# EAGLE design dev-v1.0 (EAGLE 7.2.0)

## Sheet 1 of 5: Main Microcontroller
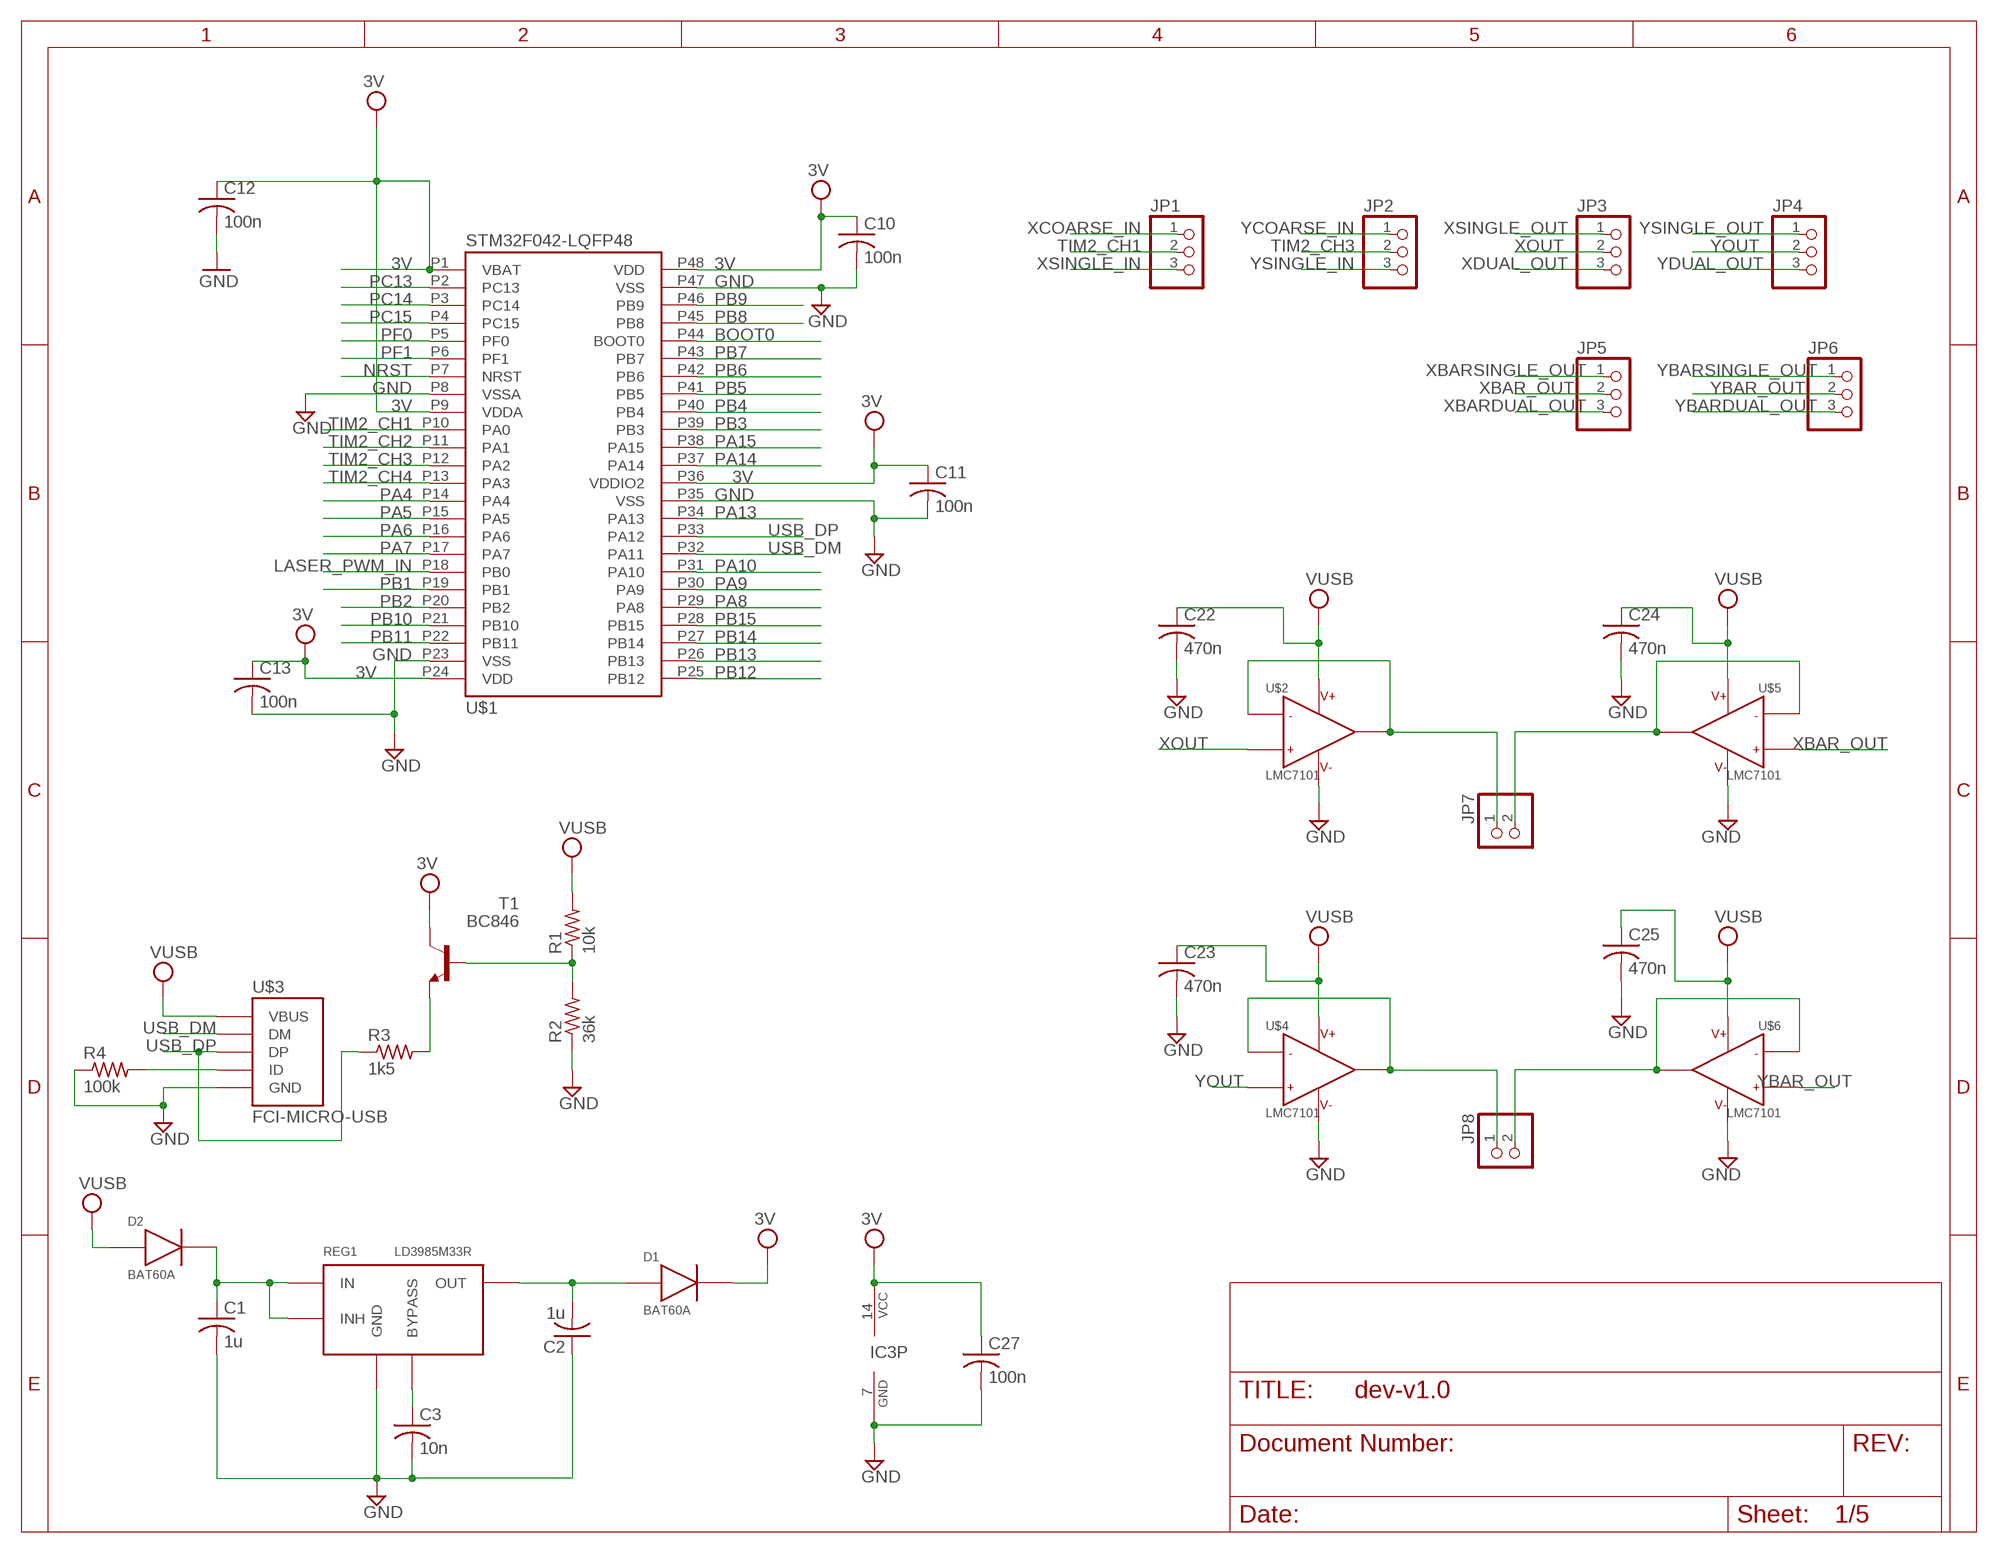
[diagram p0: schematic, sheet 1]

### Parts
C1  1u  C-USC0603  [C0603]
C2  1u  C-USC0603  [C0603]
C3  10n  C-USC0603  [C0603]
C10  100n  C-USC0603  [C0603]
C11  100n  C-USC0603  [C0603]
C12  100n  C-USC0603  [C0603]
C13  100n  C-USC0603  [C0603]
C22  470n  C-USC0603  [C0603]
C23  470n  C-USC0603  [C0603]
C24  470n  C-USC0603  [C0603]
C25  470n  C-USC0603  [C0603]
C27  100n  C-USC0603  [C0603]
D1  BAT60A  [SOD323]
D2  BAT60A  [SOD323]
IC3  74S04D  [SO14]
JP1  PINHD-1X3  [1X03]
JP2  PINHD-1X3  [1X03]
JP3  PINHD-1X3  [1X03]
JP4  PINHD-1X3  [1X03]
JP5  PINHD-1X3  [1X03]
JP6  PINHD-1X3  [1X03]
JP7  PINHD-1X2  [1X02]
JP8  PINHD-1X2  [1X02]
R1  10k  R-US_R0603  [R0603]
R2  36k  R-US_R0603  [R0603]
R3  1k5  R-US_R0603  [R0603]
R4  100k  R-US_R0603  [R0603]
REG1  LD3985M33R  LD3985MXXR  [SOT23-5L]
T1  BC846  [SOT23]
U$1  STM32F042-LQFP48  [LQFP48]
U$2  LMC7101  [SOT23-5]
U$3  FCI-MICRO-USB  [FCI-MICROUSB]
U$4  LMC7101  [SOT23-5]
U$5  LMC7101  [SOT23-5]
U$6  LMC7101  [SOT23-5]

### Nets
3V: C10.1 C11.1 C12.1 C13.1 C27.1 D1.1 IC3.14(P:VCC) T1.3(C) U$1.P1(VBAT) U$1.P9(VDDA) U$1.P24(VDD) U$1.P36(VDDIO2) U$1.P48(VDD) ; also sheet 5
3V3: C2.2 D1.2 REG1.OUT
BOOT0: U$1.P44(BOOT0) ; also sheet 5
GND: C1.2 C2.1 C3.2 C10.2 C11.2 C12.2 C13.2 C22.2 C23.2 C24.2 C25.2 C27.2 IC3.7(P:GND) R2.1 R4.1 REG1.GND U$1.P8(VSSA) U$1.P23(VSS) U$1.P35(VSS) U$1.P47(VSS) U$2.5 U$3.P5(GND) U$4.5 U$5.5 U$6.5 ; also sheet 2,3,4,5
LASER_PWM_IN: U$1.P18(PB0) ; also sheet 4,5
N$1: C3.1 REG1.BYPASS
N$2: R1.1 R2.2 T1.1(B)
N$3: R3.2 T1.2(E)
N$4: C1.1 D2.1 REG1.IN REG1.INHIBIT(INH)
N$5: R4.2 U$3.P4(ID)
N$7: JP7.1 U$2.1 U$2.4
N$9: JP8.1 U$4.1 U$4.4
N$16: JP7.2 U$5.1 U$5.4
N$17: JP8.2 U$6.1 U$6.4
NRST: U$1.P7(NRST) ; also sheet 5
PA4: U$1.P14(PA4) ; also sheet 5
PA5: U$1.P15(PA5) ; also sheet 5
PA6: U$1.P16(PA6) ; also sheet 5
PA7: U$1.P17(PA7) ; also sheet 5
PA8: U$1.P29(PA8) ; also sheet 5
PA9: U$1.P30(PA9) ; also sheet 5
PA10: U$1.P31(PA10) ; also sheet 5
PA13: U$1.P34(PA13) ; also sheet 5
PA14: U$1.P37(PA14) ; also sheet 5
PA15: U$1.P38(PA15) ; also sheet 5
PB1: U$1.P19(PB1) ; also sheet 5
PB2: U$1.P20(PB2) ; also sheet 5
PB3: U$1.P39(PB3) ; also sheet 5
PB4: U$1.P40(PB4) ; also sheet 5
PB5: U$1.P41(PB5) ; also sheet 5
PB6: U$1.P42(PB6) ; also sheet 5
PB7: U$1.P43(PB7) ; also sheet 5
PB8: U$1.P45(PB8) ; also sheet 5
PB9: U$1.P46(PB9) ; also sheet 5
PB10: U$1.P21(PB10) ; also sheet 5
PB11: U$1.P22(PB11) ; also sheet 5
PB12: U$1.P25(PB12) ; also sheet 5
PB13: U$1.P26(PB13) ; also sheet 5
PB14: U$1.P27(PB14) ; also sheet 5
PB15: U$1.P28(PB15) ; also sheet 5
PC13: U$1.P2(PC13) ; also sheet 5
PC14: U$1.P3(PC14) ; also sheet 5
PC15: U$1.P4(PC15) ; also sheet 5
PF0: U$1.P5(PF0) ; also sheet 5
PF1: U$1.P6(PF1) ; also sheet 5
TIM2_CH1: JP1.2 U$1.P10(PA0) ; also sheet 5
TIM2_CH2: U$1.P11(PA1) ; also sheet 5
TIM2_CH3: JP2.2 U$1.P12(PA2) ; also sheet 5
TIM2_CH4: U$1.P13(PA3) ; also sheet 5
USB_DM: U$1.P32(PA11) U$3.P2(DM) ; also sheet 5
USB_DP: R3.1 U$1.P33(PA12) U$3.P3(DP) ; also sheet 5
VUSB: C22.1 C23.1 C24.1 C25.1 D2.2 R1.2 U$2.2 U$3.P1(VBUS) U$4.2 U$5.2 U$6.2 ; also sheet 4
XBAR_OUT: JP5.2 U$5.3
XBARDUAL_OUT: JP5.3 ; also sheet 3
XBARSINGLE_OUT: JP5.1 ; also sheet 2
XCOARSE_IN: JP1.1 ; also sheet 3
XDUAL_OUT: JP3.3 ; also sheet 3
XOUT: JP3.2 U$2.3
XSINGLE_IN: JP1.3 ; also sheet 2
XSINGLE_OUT: JP3.1 ; also sheet 2
YBAR_OUT: JP6.2 U$6.3
YBARDUAL_OUT: JP6.3 ; also sheet 3
YBARSINGLE_OUT: JP6.1 ; also sheet 2
YCOARSE_IN: JP2.1 ; also sheet 3
YDUAL_OUT: JP4.3 ; also sheet 3
YOUT: JP4.2 U$4.3
YSINGLE_IN: JP2.3 ; also sheet 2
YSINGLE_OUT: JP4.1 ; also sheet 2

## Sheet 2 of 5: Single PWM
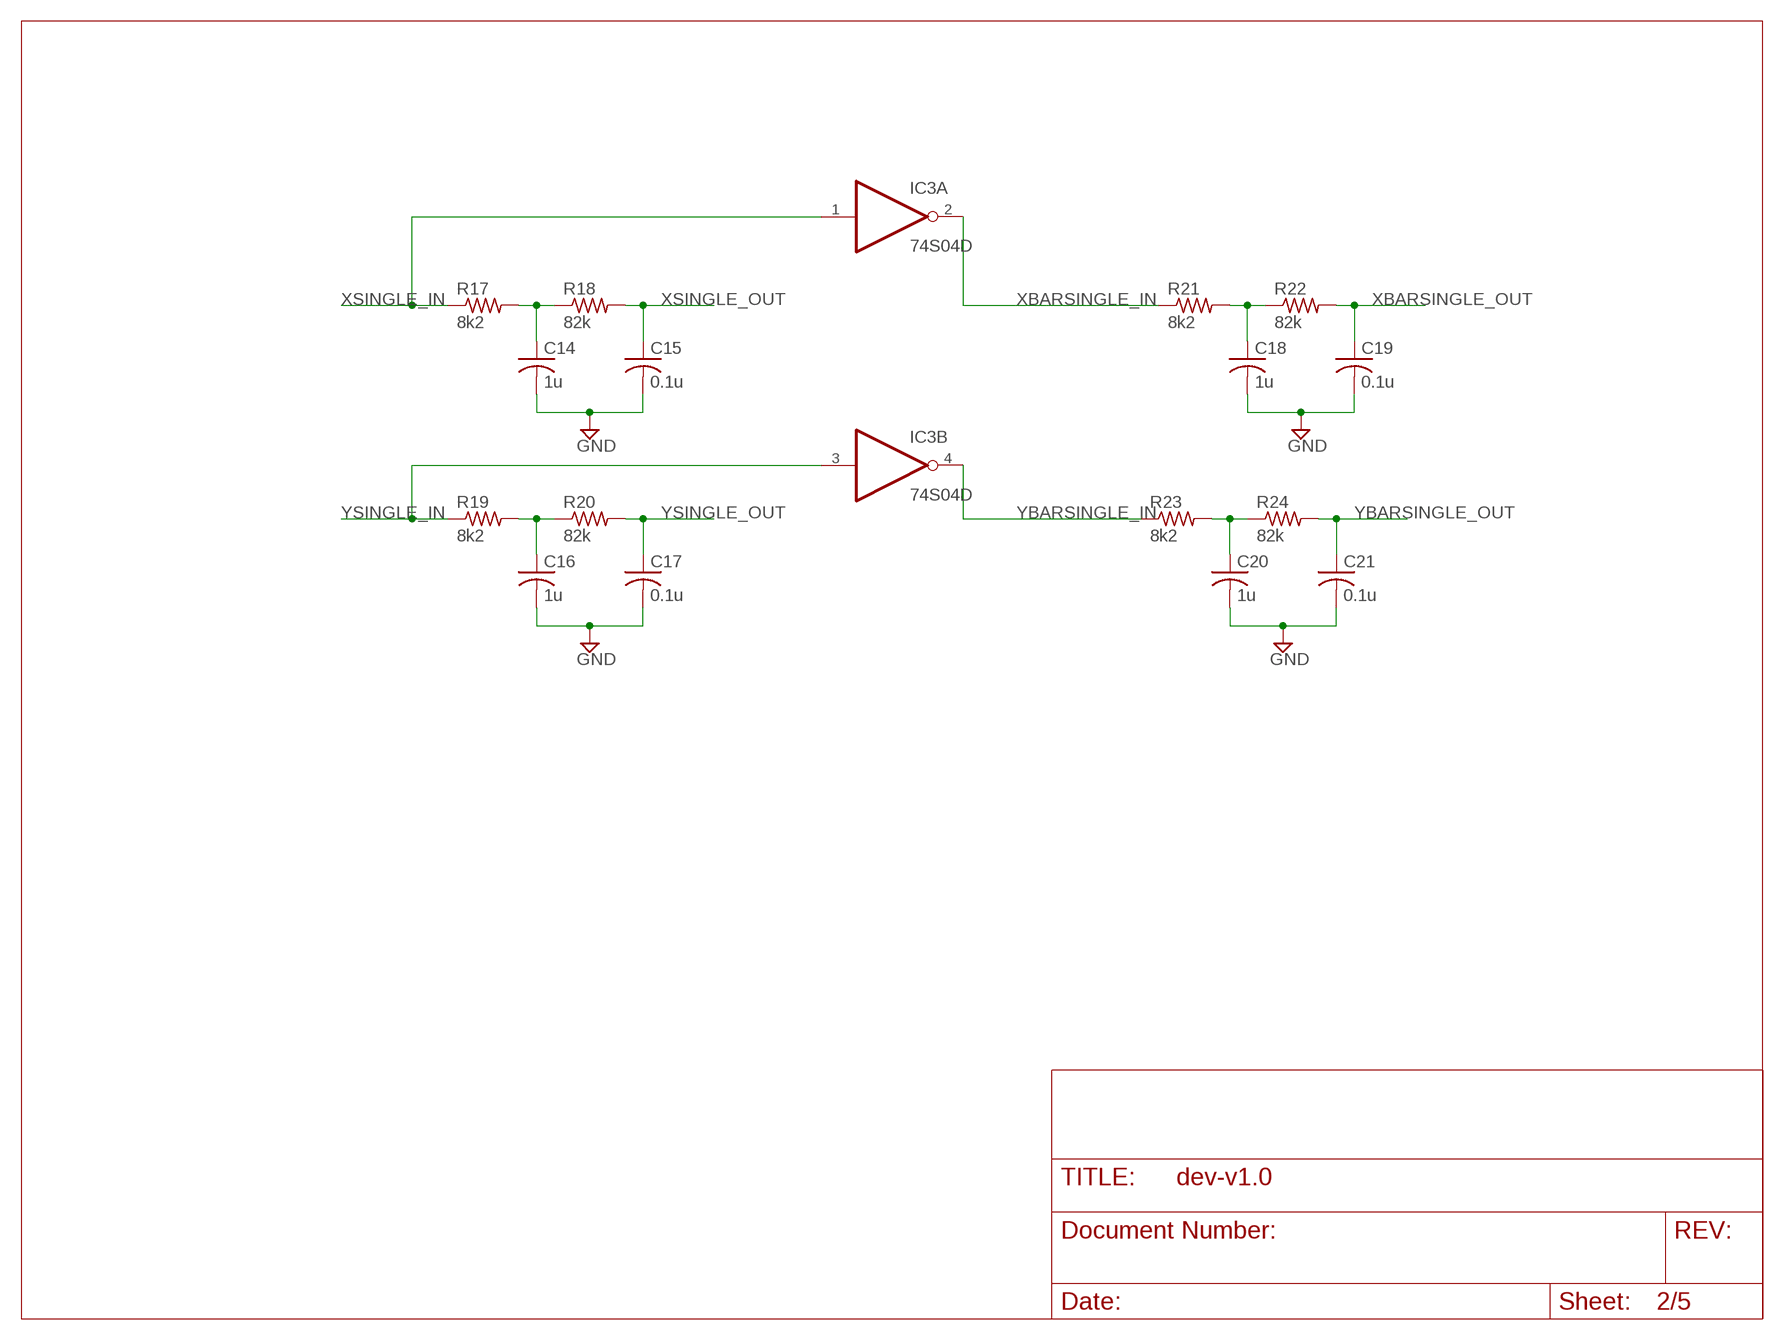
[diagram p1: schematic, sheet 2]

### Parts
C14  1u  C-USC0603  [C0603]
C15  0.1u  C-USC0603  [C0603]
C16  1u  C-USC0603  [C0603]
C17  0.1u  C-USC0603  [C0603]
C18  1u  C-USC0603  [C0603]
C19  0.1u  C-USC0603  [C0603]
C20  1u  C-USC0603  [C0603]
C21  0.1u  C-USC0603  [C0603]
R17  8k2  R-US_R0603  [R0603]
R18  82k  R-US_R0603  [R0603]
R19  8k2  R-US_R0603  [R0603]
R20  82k  R-US_R0603  [R0603]
R21  8k2  R-US_R0603  [R0603]
R22  82k  R-US_R0603  [R0603]
R23  8k2  R-US_R0603  [R0603]
R24  82k  R-US_R0603  [R0603]

### Nets
GND: C14.2 C15.2 C16.2 C17.2 C18.2 C19.2 C20.2 C21.2 ; also sheet 1,3,4,5
N$12: C14.1 R17.2 R18.1
N$13: C16.1 R19.2 R20.1
N$14: C18.1 R21.2 R22.1
N$15: C20.1 R23.2 R24.1
XBARSINGLE_IN: IC3.2(A:O) R21.1
XBARSINGLE_OUT: C19.1 R22.2 ; also sheet 1
XSINGLE_IN: IC3.1(A:I) R17.1 ; also sheet 1
XSINGLE_OUT: C15.1 R18.2 ; also sheet 1
YBARSINGLE_IN: IC3.4(B:O) R23.1
YBARSINGLE_OUT: C21.1 R24.2 ; also sheet 1
YSINGLE_IN: IC3.3(B:I) R19.1 ; also sheet 1
YSINGLE_OUT: C17.1 R20.2 ; also sheet 1

## Sheet 3 of 5: Dual PWM
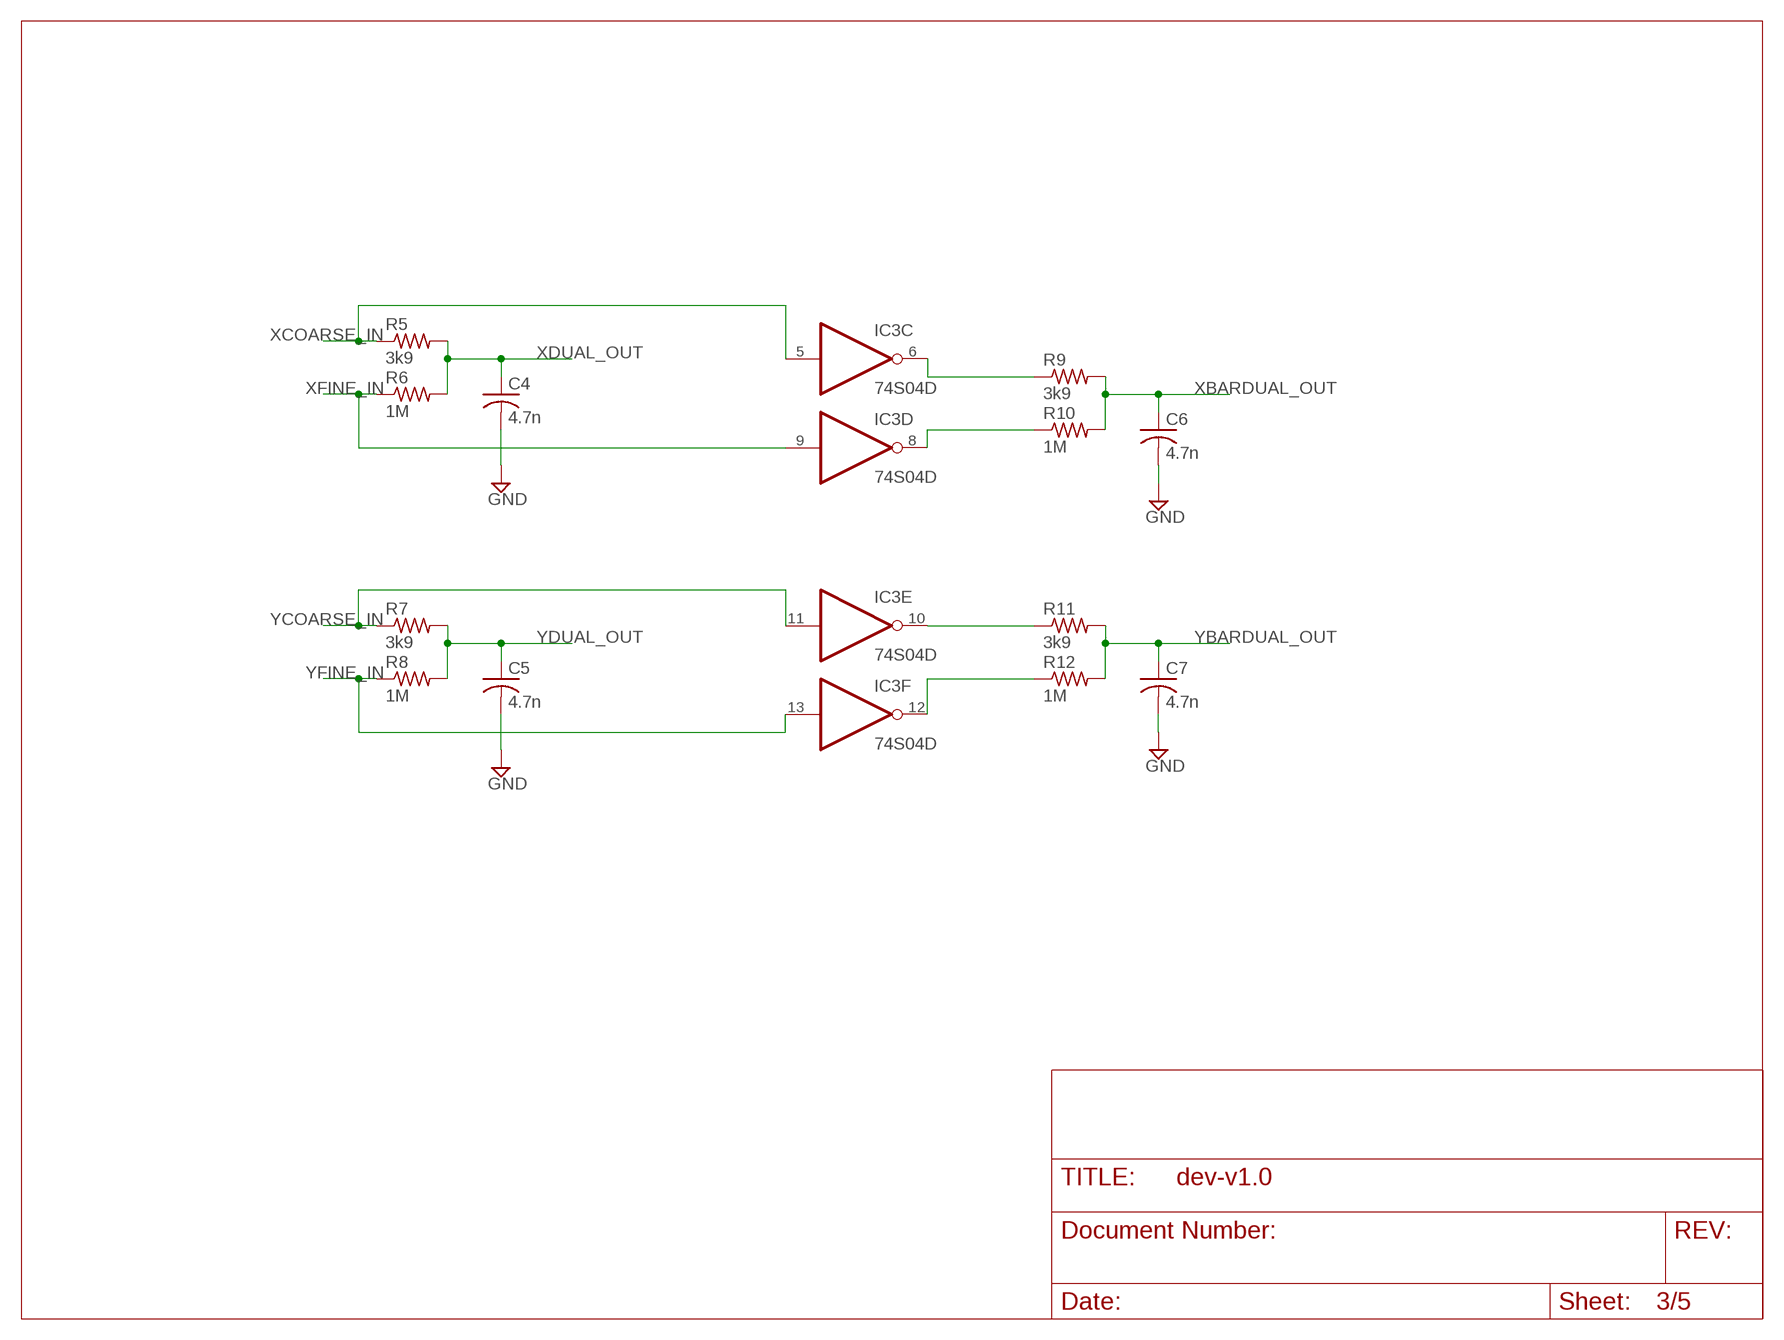
[diagram p2: schematic, sheet 3]

### Parts
C4  4.7n  C-USC0603  [C0603]
C5  4.7n  C-USC0603  [C0603]
C6  4.7n  C-USC0603  [C0603]
C7  4.7n  C-USC0603  [C0603]
R5  3k9  R-US_R0603  [R0603]
R6  1M  R-US_R0603  [R0603]
R7  3k9  R-US_R0603  [R0603]
R8  1M  R-US_R0603  [R0603]
R9  3k9  R-US_R0603  [R0603]
R10  1M  R-US_R0603  [R0603]
R11  3k9  R-US_R0603  [R0603]
R12  1M  R-US_R0603  [R0603]

### Nets
GND: C4.2 C5.2 C6.2 C7.2 ; also sheet 1,2,4,5
N$6: IC3.10(E:O) R11.1
N$8: IC3.12(F:O) R12.1
N$10: IC3.8(D:O) R10.1
N$11: IC3.6(C:O) R9.1
XBARDUAL_OUT: C6.1 R9.2 R10.2 ; also sheet 1
XCOARSE_IN: IC3.5(C:I) R5.1 ; also sheet 1
XDUAL_OUT: C4.1 R5.2 R6.2 ; also sheet 1
XFINE_IN: IC3.9(D:I) R6.1
YBARDUAL_OUT: C7.1 R11.2 R12.2 ; also sheet 1
YCOARSE_IN: IC3.11(E:I) R7.1 ; also sheet 1
YDUAL_OUT: C5.1 R7.2 R8.2 ; also sheet 1
YFINE_IN: IC3.13(F:I) R8.1

## Sheet 4 of 5: Laser Power Driver
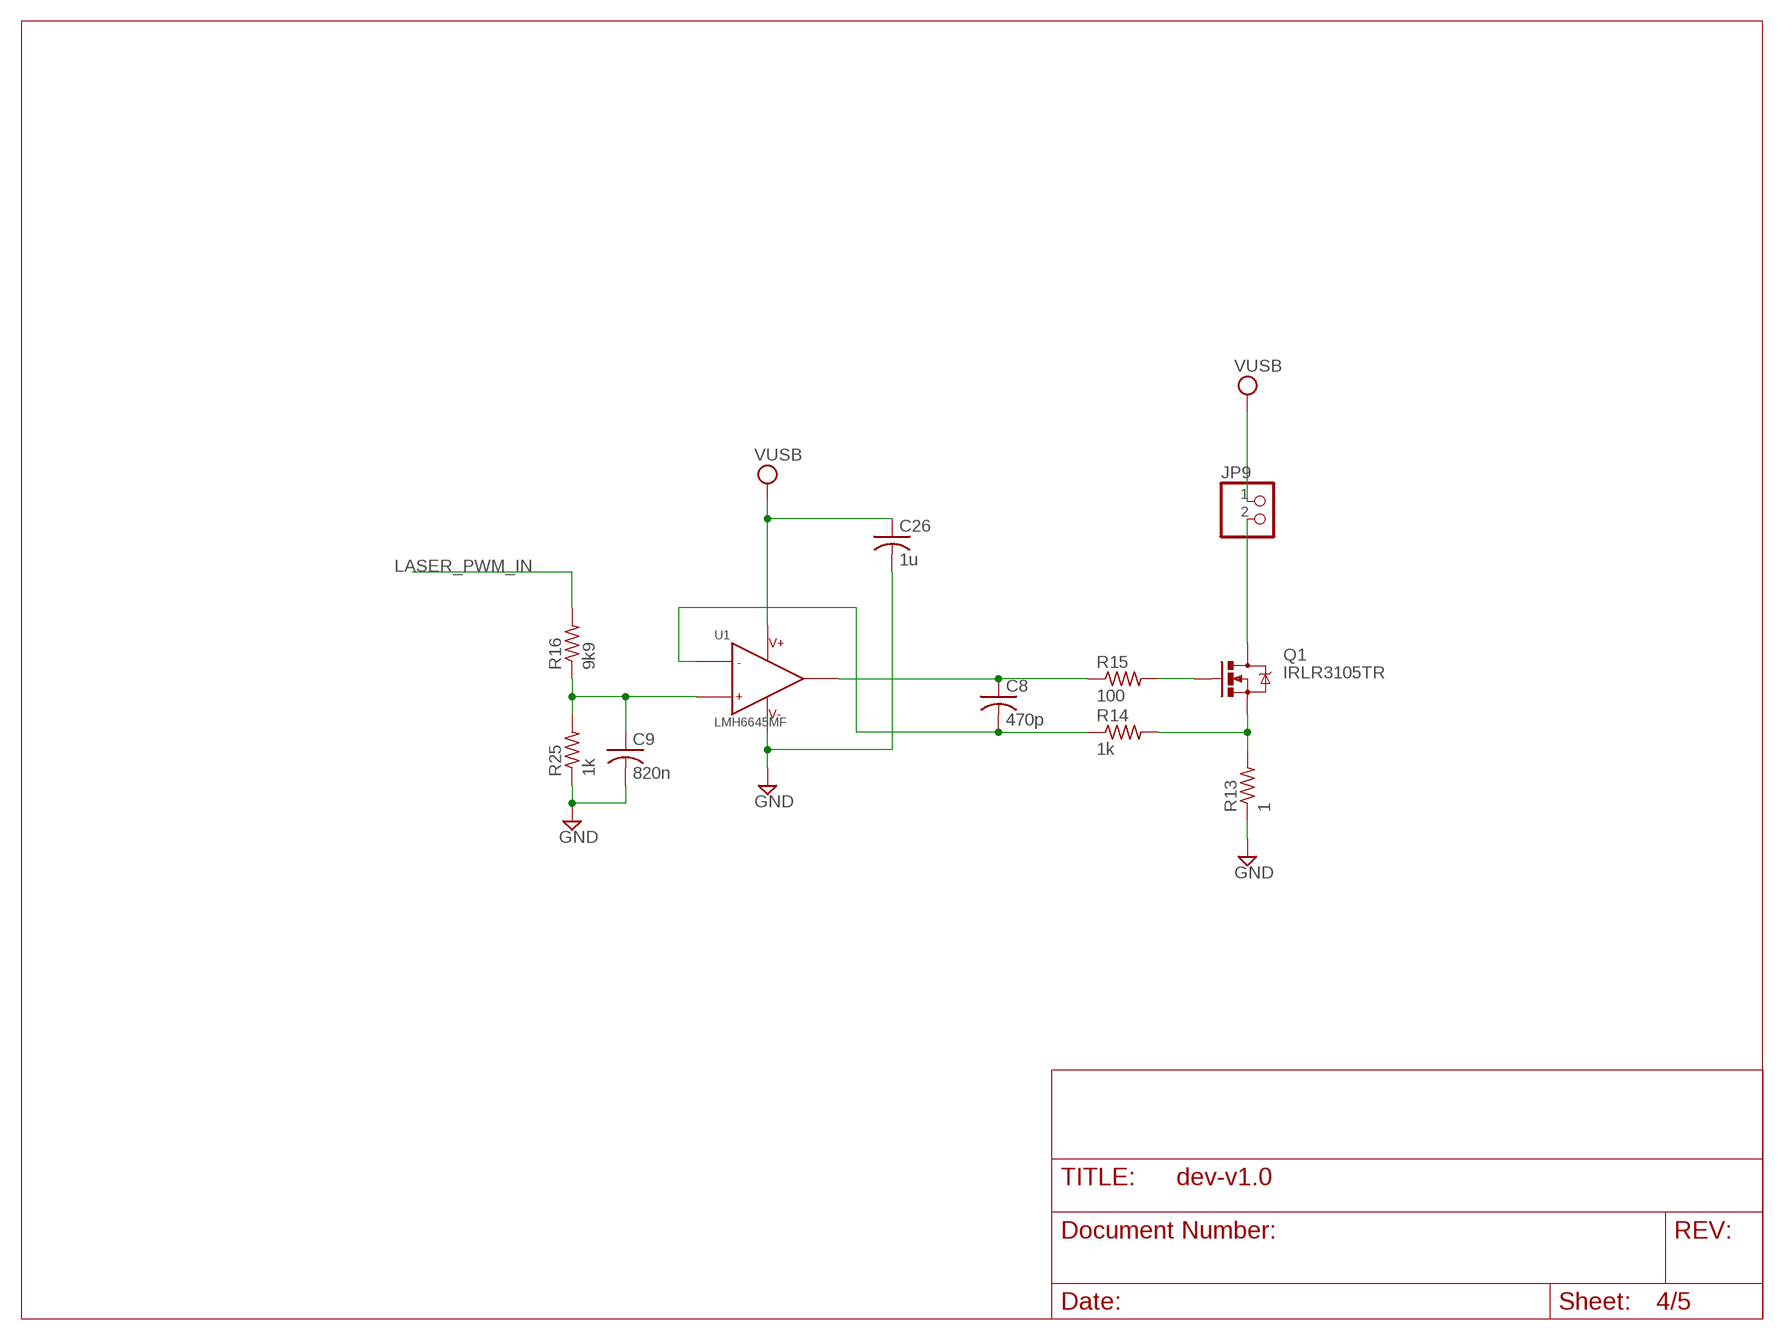
[diagram p3: schematic, sheet 4]

### Parts
C8  470p  C-USC0603  [C0603]
C9  820n  C-USC0603  [C0603]
C26  1u  C-USC0603  [C0603]
JP9  PINHD-1X2  [1X02]
Q1  IRLR3105TR  FET-N-IRLR3105TRIRLR3105TR  [DPAK]
R13  1  R-US_R0603  [R0603]
R14  1k  R-US_R0603  [R0603]
R15  100  R-US_R0603  [R0603]
R16  9k9  R-US_R0603  [R0603]
R25  1k  R-US_R0603  [R0603]
U1  LMH6645MF  OPAMP-SINGLELMH6645MF  [SOT23-5]

### Nets
GND: C9.2 C26.2 R13.1 R25.1 U1.2(V-) ; also sheet 1,2,3,5
LASER_PWM_IN: R16.2 ; also sheet 1,5
N$18: JP9.2 Q1.4(D)
N$19: Q1.3(S) R13.2 R14.2
N$20: C8.2 R14.1 U1.4(IN-)
N$21: Q1.1(G) R15.2
N$22: C8.1 R15.1 U1.1(OUT)
N$23: C9.1 R16.1 R25.2 U1.3(IN+)
VUSB: C26.1 JP9.1 U1.5(V+) ; also sheet 1

## Sheet 5 of 5
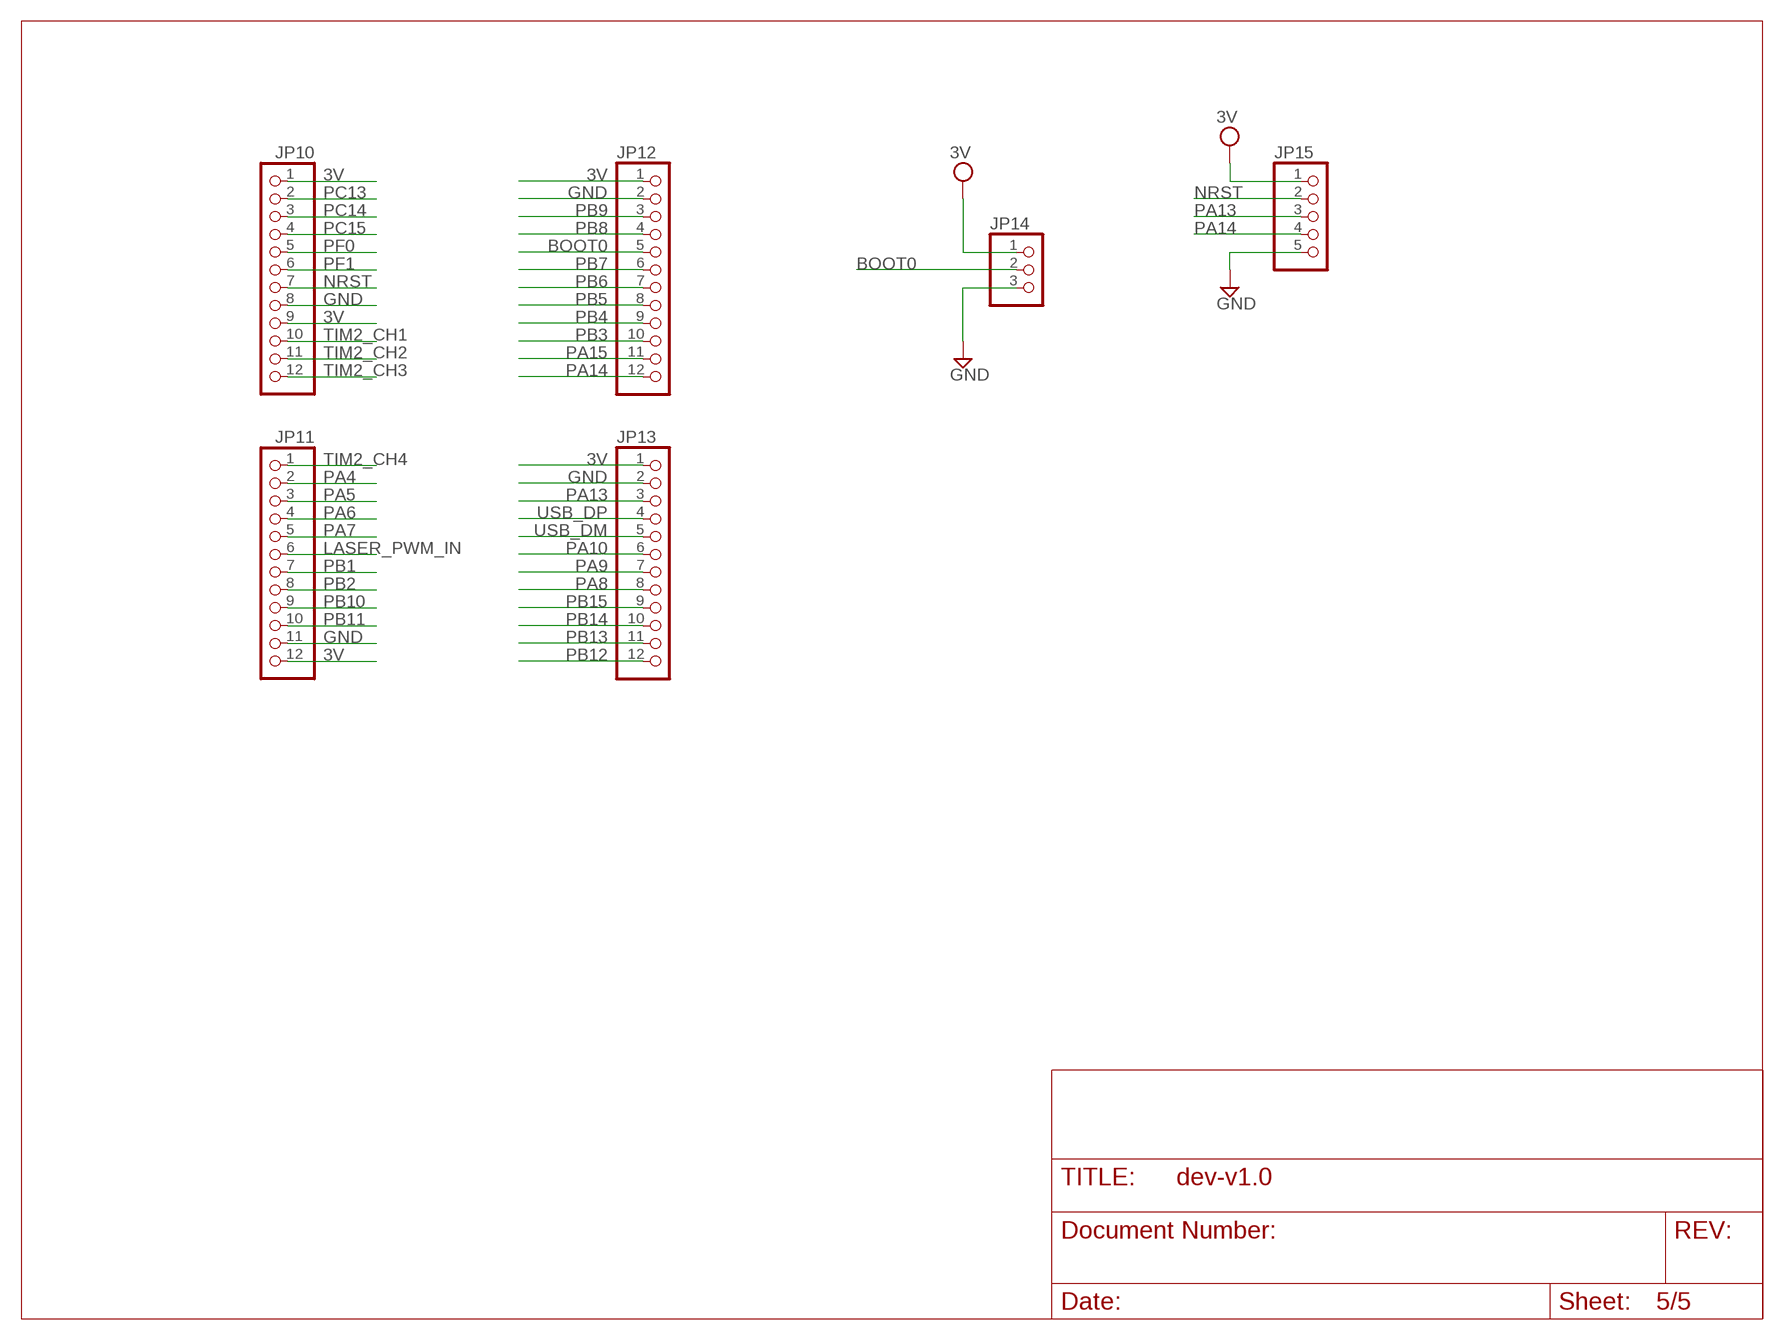
[diagram p4: schematic, sheet 5]

### Parts
JP10  PINHD-1X12  [1X12]
JP11  PINHD-1X12  [1X12]
JP12  PINHD-1X12  [1X12]
JP13  PINHD-1X12  [1X12]
JP14  PINHD-1X3  [1X03]
JP15  PINHD-1X5  [1X05]

### Nets
3V: JP10.1 JP10.9 JP11.12 JP12.1 JP13.1 JP14.1 JP15.1 ; also sheet 1
BOOT0: JP12.5 JP14.2 ; also sheet 1
GND: JP10.8 JP11.11 JP12.2 JP13.2 JP14.3 JP15.5 ; also sheet 1,2,3,4
LASER_PWM_IN: JP11.6 ; also sheet 1,4
NRST: JP10.7 JP15.2 ; also sheet 1
PA4: JP11.2 ; also sheet 1
PA5: JP11.3 ; also sheet 1
PA6: JP11.4 ; also sheet 1
PA7: JP11.5 ; also sheet 1
PA8: JP13.8 ; also sheet 1
PA9: JP13.7 ; also sheet 1
PA10: JP13.6 ; also sheet 1
PA13: JP13.3 JP15.3 ; also sheet 1
PA14: JP12.12 JP15.4 ; also sheet 1
PA15: JP12.11 ; also sheet 1
PB1: JP11.7 ; also sheet 1
PB2: JP11.8 ; also sheet 1
PB3: JP12.10 ; also sheet 1
PB4: JP12.9 ; also sheet 1
PB5: JP12.8 ; also sheet 1
PB6: JP12.7 ; also sheet 1
PB7: JP12.6 ; also sheet 1
PB8: JP12.4 ; also sheet 1
PB9: JP12.3 ; also sheet 1
PB10: JP11.9 ; also sheet 1
PB11: JP11.10 ; also sheet 1
PB12: JP13.12 ; also sheet 1
PB13: JP13.11 ; also sheet 1
PB14: JP13.10 ; also sheet 1
PB15: JP13.9 ; also sheet 1
PC13: JP10.2 ; also sheet 1
PC14: JP10.3 ; also sheet 1
PC15: JP10.4 ; also sheet 1
PF0: JP10.5 ; also sheet 1
PF1: JP10.6 ; also sheet 1
TIM2_CH1: JP10.10 ; also sheet 1
TIM2_CH2: JP10.11 ; also sheet 1
TIM2_CH3: JP10.12 ; also sheet 1
TIM2_CH4: JP11.1 ; also sheet 1
USB_DM: JP13.5 ; also sheet 1
USB_DP: JP13.4 ; also sheet 1

## Library data of the parts
C1-C27 = rcl:C-US: CAPACITOR, American symbol
D1 D2 = lmdparts:BAT60A
IC3 = lmdparts:74*04: Hex INVERTER
JP1-JP6 JP14 = pinhead:PINHD-1X3: PIN HEADER
JP7-JP9 = pinhead:PINHD-1X2: PIN HEADER
JP10-JP13 = pinhead:PINHD-1X12: PIN HEADER
JP15 = pinhead:PINHD-1X5: PIN HEADER
Q1 = lmdparts:FET-N-IRLR3105TR: Common NMOSFET Parts MFG P/N Store ID Prod ID FDD8780 TRANS-09984 SI7820DN TRANS-11055 FDS6630A IC-08089 2N7002PW TRANS-11151 FQP30N06L COM-10213 TRANS-10060 BSS123LT1G TRANS-08345 BSS138 TRANS-00830 BS170 2N7000; PROD_ID: TRANS-09984
R1-R25 = rcl:R-US_: RESISTOR, American symbol
REG1 = lmdparts:LD3985MXXR
T1 = transistor:BC846: NPN TRANSISTOR
U1 = lmdparts:OPAMP-SINGLE: Single amp opamps
U$1 = lmdparts:STM32F042-LQFP48
U$2 U$4-U$6 = lmdparts:LMC7101
U$3 = lmdparts:FCI-MICRO-USB

## Net classes
1 Power: width 0.406 mm

## Board
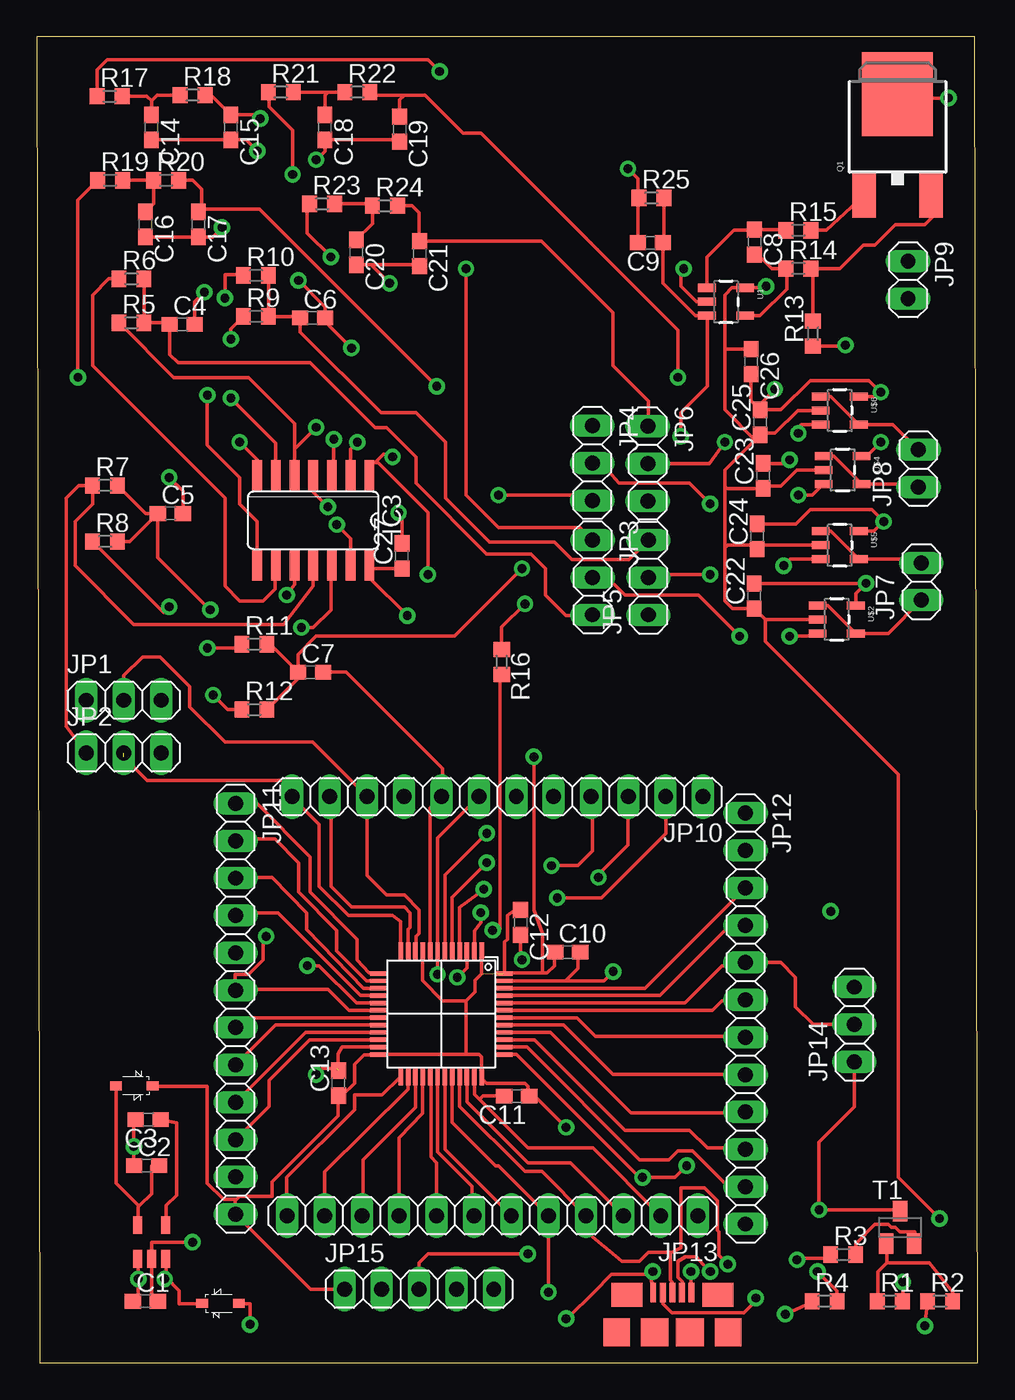
[diagram p5: board, top side]
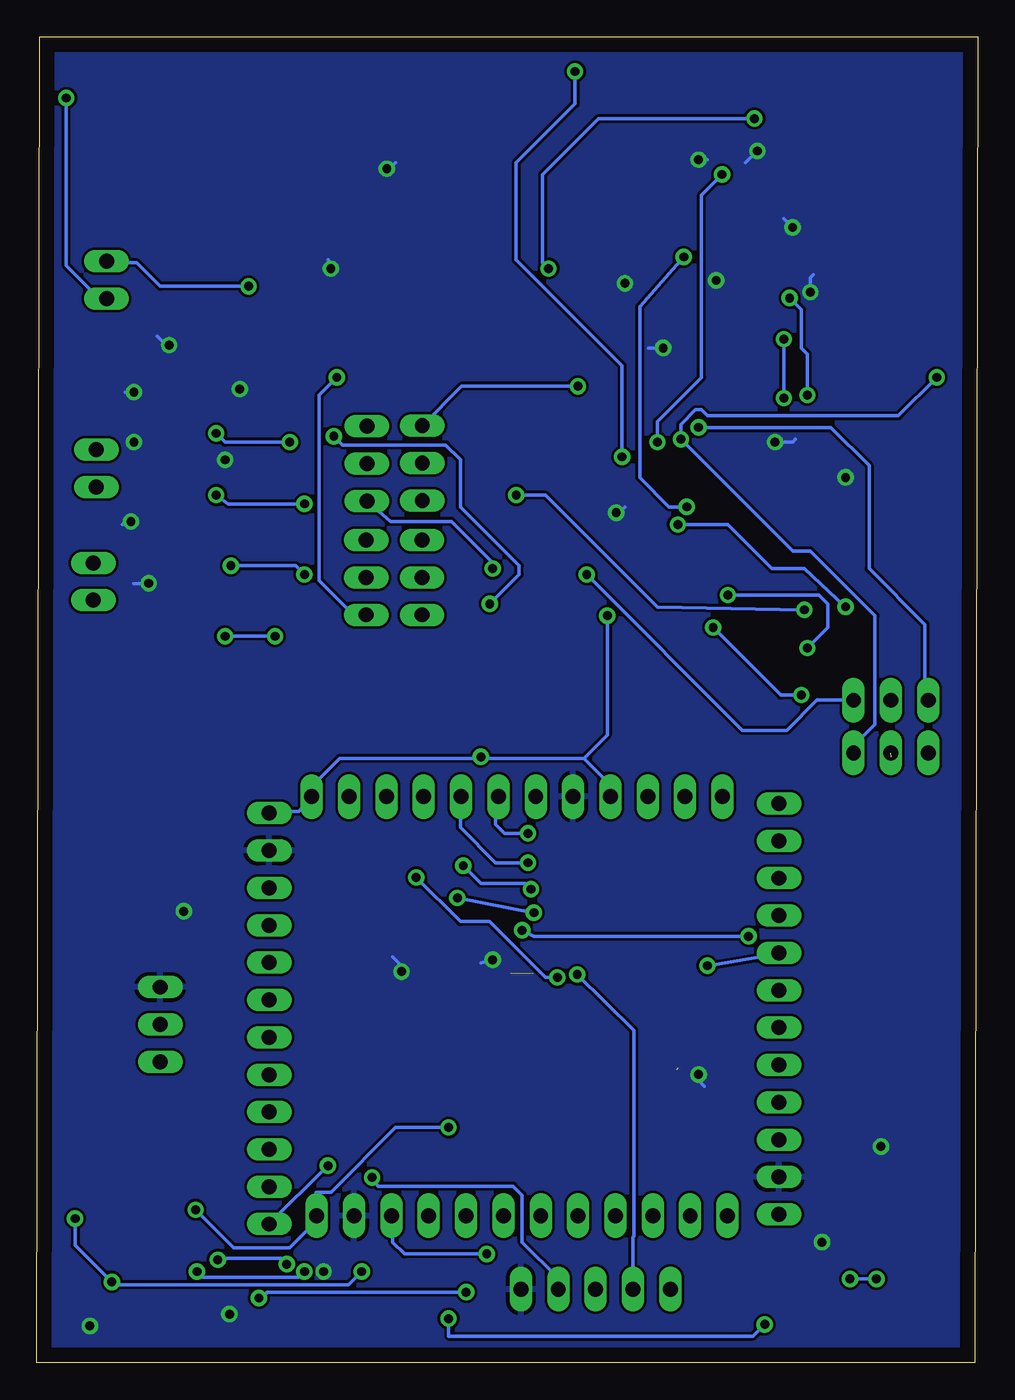
[diagram p6: board, bottom side, seen from below]

Size 64 x 90.17 mm. Coordinates in mm from the lower left corner, seen from the top.
Outline: 0.2,0 64,0 63.8,90.17 0,90.17 0.2,0
Copper layers (1*16): Top 0.035mm / dielectric 1.5mm / Bottom 0.035mm
Design rules "APCircuitsDRU": minimum track width 7mil, minimum drill 16mil, track to track 7mil, track to pad 7mil, pad to pad 7mil, via to via 7mil, smd to smd 7mil, copper to edge 40mil, drill to drill 12mil, minimum pad ring 10mil, minimum via ring 10mil, stop-mask expansion 2mil, vias tented up to drill 1mil, thermal gap 10mil

### Footprints (pad centres in the part's own frame; a part is rotated, then mirrored left to right if it is on the bottom)
C0603 = smd 1.1 x 1: 1 -0.85,0; 2 0.85,0
SOD323 = smd 0.6 x 0.8: 1 0,1.25; 2 0,-1.25
SO14 = smd 0.66 x 2.032: 1 -3.81,-3.073; 2 -2.54,-3.073; 3 -1.27,-3.073; 4 0,-3.073; 5 1.27,-3.073; 6 2.54,-3.073; 7 3.81,-3.073; 8 3.81,3.073; 9 2.54,3.073; 10 1.27,3.073; 11 0,3.073; 12 -1.27,3.073; 13 -2.54,3.073; 14 -3.81,3.073
1X03 = drill 1.016 long: 1 -2.54,0; 2 0,0; 3 2.54,0
1X02 = drill 1.016 long: 1 -1.27,0; 2 1.27,0
1X12 = drill 1.016 long: 1 -13.97,0; 2 -11.43,0; 3 -8.89,0; 4 -6.35,0; 5 -3.81,0; 6 -1.27,0; 7 1.27,0; 8 3.81,0; 9 6.35,0; 10 8.89,0; 11 11.43,0; 12 13.97,0
1X05 = drill 1.016 long: 1 -5.08,0; 2 -2.54,0; 3 0,0; 4 2.54,0; 5 5.08,0
DPAK = smd 1.6 x 3: 1 -2.28,-5.31; 3 2.28,-5.31 | smd 4.826 x 5.715: 4 0,1.588
R0603 = smd 1 x 1.1: 1 -0.85,0; 2 0.85,0
SOT23-5L = smd 0.6 x 1.2: BYPASS -0.95,-1.15; GND 0,1.15; IN 0.95,1.15; INHIBIT -0.95,1.15; OUT 0.95,-1.15
SOT23 = smd 1 x 1.4: 1 -0.95,-1.1; 2 0.95,-1.1; 3 0,1.1
SOT23-5 = smd 0.55 x 1.2: 1 -0.95,-1.3; 2 0,-1.3; 3 0.95,-1.3; 4 0.95,1.3; 5 -0.95,1.3
LQFP48 = smd 0.3 x 1.2: P1 -2.75,-0.6; P2 -2.25,-0.6; P3 -1.75,-0.6; P4 -1.25,-0.6; P5 -0.75,-0.6; P6 -0.25,-0.6; P7 0.25,-0.6; P8 0.75,-0.6; P9 1.25,-0.6; P10 1.75,-0.6; P11 2.25,-0.6; P12 2.75,-0.6; P25 2.75,7.9; P26 2.25,7.9; P27 1.75,7.9; P28 1.25,7.9; P29 0.75,7.9; P30 0.25,7.9; P31 -0.25,7.9; P32 -0.75,7.9; P33 -1.25,7.9; P34 -1.75,7.9; P35 -2.25,7.9; P36 -2.75,7.9 | smd 1.2 x 0.3: P13 4.25,0.9; P14 4.25,1.4; P15 4.25,1.9; P16 4.25,2.4; P17 4.25,2.9; P18 4.25,3.4; P19 4.25,3.9; P20 4.25,4.4; P21 4.25,4.9; P22 4.25,5.4; P23 4.25,5.9; P24 4.25,6.4; P37 -4.25,6.4; P38 -4.25,5.9; P39 -4.25,5.4; P40 -4.25,4.9; P41 -4.25,4.4; P42 -4.25,3.9; P43 -4.25,3.4; P44 -4.25,2.9; P45 -4.25,2.4; P46 -4.25,1.9; P47 -4.25,1.4; P48 -4.25,0.9
FCI-MICROUSB = smd 0.4 x 1.35: P1 -1.3,2.7; P2 -0.65,2.7; P3 0,2.7; P4 0.65,2.7; P5 1.3,2.7 | smd 1.8 x 1.9: P$1 3.8,0; P$2 -3.8,0 | smd 1.9 x 1.9: P$3 -1.2,0; P$4 1.2,0 | smd 2.1 x 1.6: P$5 -3.1,2.55; P$6 3.1,2.55

### Placement (x,y rotation side)
C1  7.38,4.17 0 top
C2  7.48,13.41 0 top
C3  7.58,16.54 180 top
C4  9.89,70.61 0 top
C5  9.09,57.75 0 top
C6  18.75,71.04 0 top
C7  18.61,46.95 0 top
C8  48.8,76.2 270 top
C9  41.73,76.16 180 top
C10  36.11,27.93 0 top
C11  32.65,18.14 180 top
C12  32.9,29.93 270 top
C13  20.52,19.02 90 top
C14  7.8,84 270 top
C15  13.2,84 270 top
C16  7.4,77.4 270 top
C17  11,77.4 270 top
C18  19.6,84 270 top
C19  24.67,83.87 270 top
C20  21.73,75.5 270 top
C21  26.04,75.41 270 top
C22  48.8,52.15 90 top
C23  49.4,60.3 90 top
C24  49,56.19 90 top
C25  49.2,63.95 90 top
C26  48.58,68.08 270 top
C27  24.84,54.87 90 top
D1  6.63,18.83 270 top
D2  12.5,4.04 90 top
IC3  18.8,57.28 180 top
JP1  5.92,45.05 0 top
JP2  5.92,41.48 0 top
JP3  37.8,53.4 270 top
JP4  37.79,61.18 270 top
JP5  41.6,53.4 90 top
JP6  41.55,61.14 270 top
JP7  60.16,53.12 90 top
JP8  59.96,60.81 90 top
JP9  59.26,73.62 270 top
JP10  31.34,38.5 180 top
JP11  13.52,24.06 270 top
JP12  48.2,23.4 270 top
JP13  31,10 180 top
JP14  55.6,23 90 top
JP15  26,5 0 top
Q1  58.54,84.67 0 top
R1  58.02,4.18 0 top
R2  61.43,4.18 0 top
R3  54.85,7.36 0 top
R4  53.58,4.18 0 top
R5  6.45,70.71 0 top
R6  6.45,73.7 0 top
R7  4.65,59.66 0 top
R8  4.65,55.84 0 top
R9  14.91,71.14 0 top
R10  14.91,73.94 0 top
R11  14.8,48.86 0 top
R12  14.8,44.41 0 top
R13  52.78,69.98 90 top
R14  51.8,74.4 0 top
R15  51.8,77 0 top
R16  31.62,47.66 270 top
R17  4.96,86.11 0 top
R18  10.6,86.2 0 top
R19  5,80.4 0 top
R20  8.8,80.4 0 top
R21  16.6,86.4 0 top
R22  21.8,86.4 0 top
R23  19.4,78.8 0 top
R24  23.68,78.67 0 top
R25  41.8,79.2 0 top
REG1  7.82,8.22 180 top
T1  58.71,9.21 0 top
U1  46.88,72.14 270 top
U$1  27.5,27.36 180 top
U$2  54.41,50.55 270 top
U$3  43.23,2.07 0 top
U$4  54.8,60.7 270 top
U$5  54.61,55.59 270 top
U$6  54.61,64.75 270 top

### Tracks (layer width: path | path; a pad name or v marks a point on that pad's centre or on a via)
3V  (via drill 0.6, 0.61)  (1 unrouted)
  Top 0.254: 13.5,11.1 12.7,11.1 11.6,12.2 11.6,18.8 7.9,18.8 D1.1 | 13.5,11.1 13.5,10.1 JP11.12 18.61,5 JP15.1 | 31.8,26.5 34.4,26.5 | 31.8,26.5 U$1.P48 | 13.5,11.1 13.6,11.1 13.8,11.3 16,11.3 16,12.3 20.5,16.8 20.5,18.1 C13.1 20.77,18.16 21.6,19 21.6,20.3 22.25,20.95 U$1.P24 29.3,20.96 | 25,39.9 JP10.9 | v33.8,41.2 33.8,30.8 34.4,29.2 34.4,26.5 | 34.4,26.5 34.7,26.5 35.2,27 35.2,27.87 C10.1 | U$1.P1 30.25,26.45 29.8,26 29.8,25.2 29.2,24.6 | U$1.P9 26.25,27.86 26.25,26 27.6,24.6 29.2,24.6 | v25.2,50.8 22.61,53.39 IC3.14 22.8,54.02 C27.1 | 31.8,26.5 31.8,28.6 32,28.8 32,30.4 32.52,30.8 C12.1 | v36,16 33.87,18.14 C11.1 33.4,18.23 33.4,18.8 33.2,19 30.6,19 30.25,19.34 U$1.P36 30.25,20.8 30.09,20.96 29.3,20.96 | T1.3 58.62,10.4 v53.2,10.4 53.2,15 55.6,17.4 JP14.1 | 29.2,24.6 29.2,21.07 29.3,20.96
  Bottom 0.254: 26.8,41.1 33.8,41.1 | 33.8,41.1 43.4,41.1 44.8,39.7 44.8,38.6 44.9,38.5 JP10.1 45.9,38.5 45.9,37.8 46.2,37.5 46.7,37.5 46.8,37.4 48.2,37.4 JP12.1 | 26.8,41.1 25.4,39.7 25.4,38.5 JP10.9 | v33.8,41.2 33.8,41.1 | v25.2,50.8 25.2,42.7 26.8,41.1 | v36,16 39.6,16 44,11.6 45,11.6 45,10.03 | 45,10.03 JP13.1 | 45,10.03 45,9.6 46.8,7.8 50.6,7.8 v53.2,10.4
3V3
  Top 0.254: 6.9,10.7 5.4,12.2 5.4,18.8 D1.2 | 6.9,10.7 6.9,9.4 REG1.OUT | C2.2 8.3,13.4 7.8,13.4 7.8,11.5 7,10.7 6.9,10.7
BOOT0
  Top 0.254: U$1.P44 44.07,24.46 46.6,27 47.99,27 JP12.5 50.59,27.21 51.6,26.2 51.6,24.2 52.8,23 JP14.2
GND  (via drill 0.6, 0.61)  (1 unrouted)
  Top 0.254: C1.2 8.2,4.2 7.8,4.2 7.8,7 REG1.GND 7.8,7.2 7.8,8.2 v10.6,8.2 | C2.1 6.6,13.5 v6.6,14.7 6.6,16.3 6.7,16.4 C3.2 | C13.2 20.5,19.9 20.5,21 20.77,21.46 U$1.P23 | v50.9,3.3 52.7,4.1 R4.1 | v60.4,2.5 60.6,4.3 R2.1 | v44.5,6.2 44.5,4.8 U$3.P5 | U$1.P35 29.75,18.25 30.1,17.9 | 30.1,17.9 33.4,14.6 37.83,14.6 JP13.2 | C10.2 36.8,27.77 36.8,26.8 35.97,25.96 U$1.P47 38.57,25.96 v39.2,26.6 | U$1.P8 26.75,37.73 JP10.8 27.6,38.57 27.6,40.4 21.04,46.95 C7.2 | U$2.5 55.71,52.3 v56.4,53 v56.4,52.99 C22.2 | U$5.5 56.94,56.54 v57.6,57.2 56.8,58 52.6,58 51.64,57.04 C24.2 | U$6.5 57.1,65.7 v57.4,66 56.6,66.8 52.6,66.8 50.6,64.8 C25.2 | v21.4,69 19.61,70.8 C6.2 19.61,71.8 v17.8,73.6 | C4.2 10.74,72.14 v11.4,72.8 | IC3.7 14.99,61.41 v13.8,62.6 | C5.2 9.94,59.26 v9,60.2 | C14.2 C15.2 14.25,83.15 v15,82.4 | C19.2 24.54,83.15 C18.2 19.6,82.4 v19,81.8 | C16.2 C17.2 11.95,76.55 v12.6,77.2 | C21.2 25.94,74.66 C20.2 22.75,74.66 v24,73.4 | R13.1 54.94,69.14 v55,69.2 | R25.1 40.89,79.14 C9.2 40.89,80.52 v40.2,81.2 | U1.2 44.86,72.14 43.8,73.2 43.8,74.2 v44,74.4 | C12.2 32.9,27.7 v33,27.4 | C11.2 30.34,18.14 30.1,17.9 | C27.2 24.84,57.56 v24.6,57.8 | C26.2 48.58,65.42 C25.2 | 20.4,20 19.4,20 v19,19.6 | C25.2 49.2,65.19 v50.2,66.2 | C23.2 50.96,61.16 v51.2,61.4 | U$4.5 56.46,61.66 v57.4,62.6
  Bottom 0.254: v39.2,26.6 39.2,27 39.8,27.6 | v56.4,53 57.4,53 | v57.6,57.2 58,57.2 58.2,57 | v57.4,66 58,66 | v21.4,69 22.4,69 | v11.4,72.8 11.4,73.8 11.2,74 | v13.8,62.6 12.6,62.6 12.4,62.8 | v9,60.2 9,60.4 8.8,60.6 | v15,82.4 15.8,81.6 | v19,81.8 18.4,81.8 | v12.6,77.2 13.2,77.8 | v24,73.4 24.2,73.4 | v17.8,73.6 17.8,74 | v55,69.2 55.2,69.2 55.8,69.8 | v40.2,81.2 40,81.2 39.6,81.6 | v44,74.4 44,74.8 44.2,75 | v33,27.4 33.8,27.2 | v24.6,57.8 24.4,57.8 24,58.2 | v19,19.6 19,19.2 18.6,18.8 | v50.2,66.2 50.4,66.2 50.6,66.4 | v51.2,61.4 51.4,61.6 | v57.4,62.6 57.4,62.8
  other vias: 54,30.7
  pour Bottom: 0.2,0 63.7,0 63.7,89.97 0.2,90.17
LASER_PWM_IN  (via drill 0.61)
  Top 0.254: v31,29.4 31.5,29.5 31.5,46.69 R16.2 | v15.6,29 15.4,28.8 15.4,27.4 14.4,26.4 13.5,26.4 13.5,25.4 JP11.6 13.59,25.4 19.8,25.4 21.23,23.96 U$1.P18
  Bottom 0.254: v15.6,29 30.2,29 v31,29.4
N$1
  Top 0.254: C3.1 8.5,16.5 9.5,16.3 9.5,11.4 8.8,10.7 8.8,9.4 REG1.BYPASS
N$2
  Top 0.254: 57.8,6.8 57.2,6.2 57.2,4.2 R1.1 | 57.8,6.8 57.8,8.1 T1.1 | 57.8,6.8 60.7,6.8 62.3,4.8 62.3,4.2 R2.2
N$3
  Top 0.254: R3.2 55.7,7.4 55.7,8.1 57,9.4 57.9,9.4 58.1,9.2 58.4,9.2 58.7,8.9 59.7,8.9 59.7,8.2 T1.2
N$4  (via drill 0.61)
  Top 0.254: C1.1 6.6,4.2 6.9,4.2 v6.9,5.7 6.9,7 REG1.IN | 8.8,5.8 9.7,4.9 9.7,4 11.2,4 D2.1 | 8.8,5.8 8.8,7 REG1.INHIBIT | v8.7,5.7 8.7,5.8 8.8,5.8
  Bottom 0.254: v8.7,5.7 v6.9,5.7
N$5  (via drill 0.61)
  Top 0.254: v53.1,6.2 54.4,4.9 54.4,4.2 R4.2 | v45.8,6.2 45.3,6.7 44.85,7.2 44.1,7.2 43.6,6.9 43.6,5.8 43.9,5.5 43.9,4.8 U$3.P4
  Bottom 0.254: v53.1,6.2 52.7,5.8 46.2,5.8 v45.8,6.2
N$6  (via drill 0.6)
  Top 0.254: IC3.10 17.53,52.93 v17,52.2 | v11.6,48.6 13.69,48.6 R11.1
  Bottom 0.254: v17,52.2 10.8,52.2 10.2,51.6 10.2,50 v11.6,48.6
N$7
  Top 0.254: JP7.1 57.9,49.59 U$2.4 53.8,51.49 U$2.1
N$8  (via drill 0.6)
  Top 0.254: R12.1 12.98,44.41 v12,45.4 | v18,50 18.8,50 20,51.2 20,54.14 IC3.12
  Bottom 0.254: v12,45.4 13.4,45.4 v18,50
N$9
  Top 0.254: JP8.1 59.74,59.76 U$4.4 54.21,61.66 U$4.1
N$10  (via drill 0.6)
  Top 0.254: IC3.8 14.99,57.21 13.8,58.4 13.8,60.2 11.6,62.4 v11.6,65.8 | v12.8,72.4 12.8,74 13.99,74 R10.1
  Bottom 0.254: v11.6,65.8 11.6,68.6 12,69 12,71.6 v12.8,72.4
N$11  (via drill 0.6)
  Top 0.254: IC3.6 16.26,62.54 v13.2,65.6 | v13.2,69.6 13.2,70.28 R9.1
  Bottom 0.254: v13.2,65.6 v13.2,69.6
N$12
  Top 0.254: R17.2 7.49,86.11 7.8,85.8 | 7.8,85.8 C14.1 | R18.1 8.2,86.2 7.8,85.8
N$13
  Top 0.254: R19.2 R20.1 7.95,78.8 C16.1
N$14
  Top 0.254: R21.2 R22.1 19.8,86.4 19.6,86.2 C18.1
N$15
  Top 0.254: R23.2 22.7,78.8 R24.1 22.83,77.45 C20.1
N$16
  Top 0.254: JP7.2 59.91,54.64 U$5.4 54.01,56.54 U$5.1
N$17
  Top 0.254: JP8.2 58.23,63.8 U$6.4 54.01,65.7 U$6.1
N$18  (via drill 0.6)
  Top 0.254: v62,86 59,86 Q1.4
  Bottom 0.254: JP9.2 59.76,72.36 62,74.6 v62,86
N$19
  Top 0.254: R13.2 52.78,74.27 R14.2 54.6,74.4 56.2,76 57,76 58.4,77.4 60.4,77.4 61,78 61,79.38 Q1.3
N$20
  Top 0.254: C8.2 49.05,75.35 50,74.4 R14.1 51,74.35 51,73 49.19,71.19 U1.4
N$21
  Top 0.254: R15.2 53.7,77 Q1.1
N$22
  Top 0.254: R15.1 50.9,77.05 C8.1 48.75,77 47.4,77 45.58,75.17 U1.1
N$23  (via drill 0.6)
  Top 0.254: R25.2 42.65,76.22 C9.1 42.59,73.42 44.8,71.2 U1.3 45.6,71.17 45.6,66.4 43.8,64.6 v43.8,63 | R16.1 31.62,50.02 v33.2,51.6
  Bottom 0.254: v33.2,51.6 31.2,53.6 31.2,54.2 35.2,58.2 35.2,61.4 36.2,62.4 43.2,62.4 v43.8,63
NRST  (via drill 0.6)
  Top 0.254: JP10.7 27.25,35.69 U$1.P7 27.25,27.86 v27.25,26.4
  Bottom 0.254: JP15.2 23.46,8.54 23.4,8.6 23.4,22.6 v27.25,26.4
PA4
  Top 0.254: U$1.P14 22.43,25.96 20.4,28 20.4,29.4 17.8,32 17.8,34 16.2,35.6 13.63,35.6 JP11.2
PA5
  Top 0.254: U$1.P15 22.23,25.46 18.35,29.45 18.35,30.6 16,33 13.57,33 JP11.3
PA6
  Top 0.254: U$1.P16 22.04,24.96 16.4,30.6 13.71,30.6 JP11.4
PA7  (via drill 0.6)
  Top 0.254: U$1.P17 21.73,24.46 19.2,27 v18.4,27
  Bottom 0.254: v18.4,27 13.59,27.8 JP11.5
PA8
  Top 0.254: JP13.8 27.19,13.61 26.8,14 26.8,19.42 U$1.P29
PA9
  Top 0.254: U$1.P30 27.25,14.35 29.6,12 29.6,10.13 JP13.7
PA10
  Top 0.254: U$1.P31 27.75,14.52 JP13.6
PA13  (via drill 0.6)
  Top 0.254: U$1.P34 29.25,17.75 33.4,13.6 36.29,13.6 JP13.3 | JP15.3 26,6.8 26.6,7.4 v33.4,7.4
  Bottom 0.254: v33.4,7.4 39,7.4 39.8,8.2 39.8,9.91 JP13.3
PA14  (via drill 0.6)
  Top 0.254: U$1.P37 32.64,20.96 41,12.6 v41.2,12.6 | v41.2,12.6 43.4,12.6 v44.2,13.4 | v41.2,12.6 41.6,12.6
  Bottom 0.254: v44.2,13.4 44.23,13.4 JP12.12 | JP15.4 28.54,5.74 31,8.2 31,11.4 31.6,12 40.8,12 v41.2,12.6
PA15
  Top 0.254: U$1.P38 33.34,21.46 41,13.8 43,13.8 43.6,14.4 44.6,14.4 47,12 48.17,12 JP12.11
PB1
  Top 0.254: U$1.P19 14.2,23.46 JP11.7
PB2
  Top 0.254: U$1.P20 16.24,22.96 JP11.8
PB3
  Top 0.254: U$1.P39 33.84,21.96 40,15.8 44.4,15.8 45.6,14.6 48.11,14.6 JP12.10
PB4
  Top 0.254: U$1.P40 34.94,22.46 40.4,17 48.15,17 JP12.9
PB5
  Top 0.254: U$1.P41 35.84,22.96 39.2,19.6 JP12.8
PB6
  Top 0.254: U$1.P42 36.73,23.46 38,22.2 48.13,22.2 JP12.7
PB7
  Top 0.254: U$1.P43 45.97,23.96 46.6,24.6 48.13,24.6 JP12.6
PB8
  Top 0.254: U$1.P45 42.37,24.96 47.2,29.8 48.15,29.8 JP12.4
PB9
  Top 0.254: U$1.P46 41.38,25.46 JP12.3
PB10
  Top 0.254: U$1.P21 18.28,22.46 JP11.9
PB11
  Top 0.254: U$1.P22 18.56,21.96 15.8,19.2 15.8,17.45 JP11.10
PB12
  Top 0.254: U$1.P25 24.7,19.4 23.5,18.2 21.6,18.2 21.6,17.2 17,12.6 17,10 JP13.12
PB13
  Top 0.254: JP13.11 19.57,12.97 25.25,18.6 U$1.P26
PB14
  Top 0.254: U$1.P27 25.75,17.36 22.2,13.8 22.2,10.09 JP13.10
PB15
  Top 0.254: JP13.9 24.65,15.3 26.25,16.95 26.25,19.41 U$1.P28
PC13  (via drill 0.6)
  Top 0.254: 42.7,38.5 JP10.2 42.8,38.47 42.8,36 38.4,31.6 v35.4,31.6 | U$1.P2 29.75,29.36 30.2,29.95 v30.2,30.6
  Bottom 0.254: v30.2,30.6 v35.4,31.6
PC14  (via drill 0.6)
  Top 0.254: U$1.P3 29.25,26.86 v28.6,26.2 | v38.2,33 38.2,33.2 40.2,35.2 40.2,38.47 JP10.3
  Bottom 0.254: v28.6,26.2 29.4,26.2 33.2,30 35.2,30 v38.2,33
PC15  (via drill 0.6)
  Top 0.254: U$1.P4 28.75,30.95 v30.4,32.2 | v35,33.8 36.8,33.8 37.8,34.8 37.8,38.39 JP10.4
  Bottom 0.254: v30.4,32.2 30.8,32.6 33.8,32.6 v35,33.8
PF0  (via drill 0.6)
  Top 0.254: U$1.P5 28.25,31.66 v30.6,34
  Bottom 0.254: v30.6,34 32.8,34 35.2,36.4 35.2,38.45 JP10.5
PF1  (via drill 0.6)
  Top 0.254: U$1.P6 27.75,33.16 v30.6,36
  Bottom 0.254: v30.6,36 32.2,36 32.8,36.6 32.8,38.31 JP10.6
TIM2_CH1
  Top 0.254: U$1.P10 25.8,28.01 25.8,29 26,29.2 26,30.8 25,31.8 23.8,31.8 22.45,33.15 JP10.10 18.75,42.2 12.8,42.2 10.4,44.6 10.4,46 8.4,48 7.2,48 5.92,46.72 JP1.2
TIM2_CH2
  Top 0.254: U$1.P11 25.25,29.45 25.4,29.6 25.4,30.6 25,31 21.4,31 20,32.4 20,38.41 JP10.11
TIM2_CH3  (1 unrouted)
  Top 0.254: 5.9,41.2 7.5,39.6 17.4,39.6 17.4,38.6 JP10.12 17.37,38.43 19.2,36.6 19.2,32.4 21.2,30.4 24.2,30.4 24.75,30 24.75,28.12 U$1.P12
TIM2_CH4
  Top 0.254: JP11.1 14.97,38.03 18.6,34.4 18.6,32 21.8,28.8 21.8,27.4 22.6,26.5 23.24,26.5 U$1.P13
USB_DM  (via drill 0.61)
  Top 0.254: v48.9,4.4 48.7,4 48.1,3.4 43.2,3.4 42.6,4 42.6,4.7 U$3.P2 | v34.8,4.8 JP13.5 31.41,13.4 31.2,13.4 28.25,16.34 U$1.P32
  Bottom 0.254: v48.9,4.4 48.3,4.8 v34.8,4.8
USB_DP  (via drill 0.61)
  Top 0.254: 43.1,7.5 41.6,7.5 41,6.9 39.8,6.9 37.4,8.9 37.4,10 JP13.4 34.35,13 33.2,13 28.75,17.45 U$1.P33 | 43.1,7.5 43.1,5.6 43.2,5.5 43.2,4.8 U$3.P3 | v51.7,7 52.1,7.1 53.7,7.1 53.9,7.3 R3.1 | v47,6.7 46.4,7.3 46.4,8.9 46.3,9 46.3,11 45.4,11.9 43.8,11.9 43.8,7.8 43.2,7.5 43.1,7.5
  Bottom 0.254: v51.7,7 51.4,7.1 47.4,7.1 v47,6.7
VUSB  (via drill 0.6, 0.61)
  Top 0.254: v14.5,2.6 14.5,4 13.8,4 D2.2 | v36,3 36.15,3.1 37.9,4.8 39.1,6 41.8,6 | 41.8,6 41.8,5.5 41.9,5.4 41.9,4.8 U$3.P1 | v58.9,5.5 58.9,4.2 R1.2 | v41.9,6.2 41.9,6 41.8,6 | U$5.2 49.25,55.59 | 49.25,55.59 C24.1 | U$2.2 49.55,50.55 | 49.55,50.55 C22.1 47.3,51.3 46.8,51.8 46.8,55.4 | U$4.2 51.71,60.7 50.6,59.6 49.54,59.6 C23.1 46.95,59.45 46.8,59.6 | 46.8,55.4 46.8,59.6 | 46.8,59.6 46.8,60.7 48.85,62.75 | 48.85,62.75 C25.1 49.3,63.2 50.2,63.2 51.75,64.75 U$6.2 | 49.25,55.59 46.99,55.59 46.8,55.4 | 49.55,50.55 49.55,49.05 58.6,40 58.6,12.6 v61.4,9.8 | v49.6,73.2 49.49,73.09 U1.5 47.29,73.09 46.8,72.6 46.8,69 | 46.8,69 46.8,64.8 48.85,62.75 | C26.1 46.88,68.92 46.8,69
  Bottom 0.254: v14.5,2.6 15.3,1.8 36,1.8 v36,3 | v41.9,6.2 42.8,5.3 58.7,5.3 v58.9,5.5 61.4,8 v61.4,9.8 | v49.6,73.2 55.6,73.2 57.2,74.8 59.16,74.8 JP9.1
XBAR_OUT  (via drill 0.6)
  Top 0.254: U$5.3 51.24,54.64 v50.8,54.2 | v45.8,53.6 41.8,53.6 JP5.2
  Bottom 0.254: v50.8,54.2 46.4,54.2 v45.8,53.6
XBARDUAL_OUT
  Top 0.254: R10.2 R9.2 17.8,71.14 C6.1 17.9,70.09 23.4,64.6 25.8,64.6 27.8,62.6 27.8,58.8 30.8,55.8 35.2,55.8 36.4,54.6 40.26,54.6 JP5.3
XBARSINGLE_IN  (via drill 0.6)
  Top 0.254: IC3.2 21.34,62.14 v21.8,62.6 | v17.4,80.8 17.4,83.8 15.8,85.4 15.8,86.35 R21.1
  Bottom 0.254: v21.8,62.6 21.8,64 18.8,67 18.8,79.4 v17.4,80.8
XBARSINGLE_OUT  (via drill 0.6)
  Top 0.254: v43.6,67 43.6,70.2 30.2,83.6 29,83.6 26.4,86.2 25,86.2 | 25,86.2 22.85,86.2 R22.2 | C19.1 24.67,85.87 25,86.2
  Bottom 0.254: JP5.1 42.46,50.86 44.8,53.2 44.8,65.8 v43.6,67
XCOARSE_IN  (via drill 0.6)
  Top 0.254: R5.1 9.3,67 14.4,67 17.53,63.87 IC3.5 17.53,62.13 v19,63.6
  Bottom 0.254: v19,63.6 10,63.6 7.4,61 7.4,54 3.6,50.2 3.6,45.27 JP1.1
XDUAL_OUT
  Top 0.254: R6.2 R5.2 8.93,70.71 C4.1 9.04,68.56 9.6,68 18.6,68 23,63.6 23.8,63.6 25.8,61.6 25.8,59.8 30.6,55 33.6,55 34.6,54 34.6,52.2 36,50.8 37.74,50.8 JP3.3
XFINE_IN
  Top 0.254: R6.1 4.9,73.7 3.8,72.6 3.8,67.8 12.8,58.8 12.8,52.8 13.8,51.8 15.4,51.8 16.2,52.6 16.2,54.15 IC3.9
XOUT  (via drill 0.6)
  Top 0.254: JP3.2 38.8,53.4 40,52.2 45,52.2 v47.8,49.4 | v51.2,49.4 52.91,49.4 U$2.3
  Bottom 0.254: v47.8,49.4 v51.2,49.4
XSINGLE_IN  (via drill 0.6)
  Top 0.254: v26.6,53.6 26.6,57.8 23.2,61.2 23,61.2 | 23,61.2 22.6,61.2 22.6,60.36 IC3.1 | R17.1 4.11,87.91 4.8,88.6 26.6,88.6 v27.4,87.8 | v24.2,61.6 23.6,61.8 23,61.2
  Bottom 0.254: JP1.3 10.95,45.05 13,43 16,43 v26.6,53.6 | v27.4,87.8 27.4,85.6 31.4,81.6 31.4,75 24.2,67.8 v24.2,61.6
XSINGLE_OUT  (via drill 0.6)
  Top 0.254: R18.2 11.85,86.2 C15.1 14.95,84.85 v15.2,84.6 | v29.2,74.4 29.2,59 31.4,56.8 36.94,56.8 JP3.1
  Bottom 0.254: v15.2,84.6 25.8,84.6 29.6,80.8 29.6,74.8 v29.2,74.4
YBAR_OUT  (via drill 0.6)
  Top 0.254: v46.8,62.6 45.74,61.14 JP6.2 | 53,63.8 U$6.3 52,63.8 51.8,63.6 v51.8,63.2
  Bottom 0.254: v46.8,62.6 51.2,62.6 v51.8,63.2
YBARDUAL_OUT  (via drill 0.6)
  Top 0.254: C7.1 17.77,48.16 19,49.4 28.4,49.4 v33,54 | R11.2 15.86,48.86 C7.1 | C7.1 17.77,46.52 R12.2
  Bottom 0.254: v33,54 33,54.4 35.8,57.2 39.95,57.2 JP6.3
YBARSINGLE_IN  (via drill 0.6)
  Top 0.254: IC3.4 18.8,59.2 v19.8,58.2 | v20,75.2 18.4,76.8 18.4,78.65 R23.1
  Bottom 0.254: v19.8,58.2 21,58.2 23,60.2 23,71.8 v20,75.2
YBARSINGLE_OUT
  Top 0.254: R24.2 25.53,78.67 26,78.2 26,76.3 C21.1 34.34,76.26 39.2,71.4 39.2,67.8 41.6,65.4 41.6,63.73 JP6.1
YCOARSE_IN
  Top 0.254: JP2.1 2,43.25 2,58.8 2.85,59.66 R7.1 3.8,58.4 2.6,57.2 2.6,54.2 6.6,50.2 16.8,50.2 18.8,52.8 IC3.11
YDUAL_OUT  (via drill 0.6)
  Top 0.254: R8.2 6.33,55.84 C5.1 | C5.1 7.4,57.75 R7.2 | C5.1 8.24,54.76 v11.8,51.2 | v31.4,59 37.43,59 JP4.3
  Bottom 0.254: v11.8,51.2 21.8,51.4 29.4,59 v31.4,59
YFINE_IN  (via drill 0.6)
  Top 0.254: IC3.13 21.34,56.06 v20.4,57 | v9,51.4 8.64,51 R8.1
  Bottom 0.254: v20.4,57 17,57 14,54 11.8,54 v9,51.4
YOUT  (via drill 0.6)
  Top 0.254: JP4.2 38.42,61.18 39.6,59.8 44.4,59.8 v45.8,58.4 | v51.8,59 52.75,59 U$4.3
  Bottom 0.254: v45.8,58.4 51,58.4 v51.8,59
YSINGLE_IN  (via drill 0.6)
  Top 0.254: v20.2,62.8 20.2,60.48 IC3.3 | v2.8,67 2.8,79.05 R19.1
  Bottom 0.254: JP2.3 8.46,41.95 7,43.4 7,50.8 11.4,55.2 12.6,55.2 v20.2,62.8 20.2,63.8 19.2,64.8 18.8,64.8 18.4,64.4 5.4,64.4 v2.8,67
YSINGLE_OUT  (via drill 0.6)
  Top 0.254: R20.2 10.6,80.4 11.2,79.8 11.2,78.45 | 11.2,78.45 C17.1 | 11.2,78.45 15.15,78.45 v27.2,66.4
  Bottom 0.254: v27.2,66.4 35.11,66.4 JP4.1